# EAGLE design PlugRev1 (EAGLE 7.5.0)
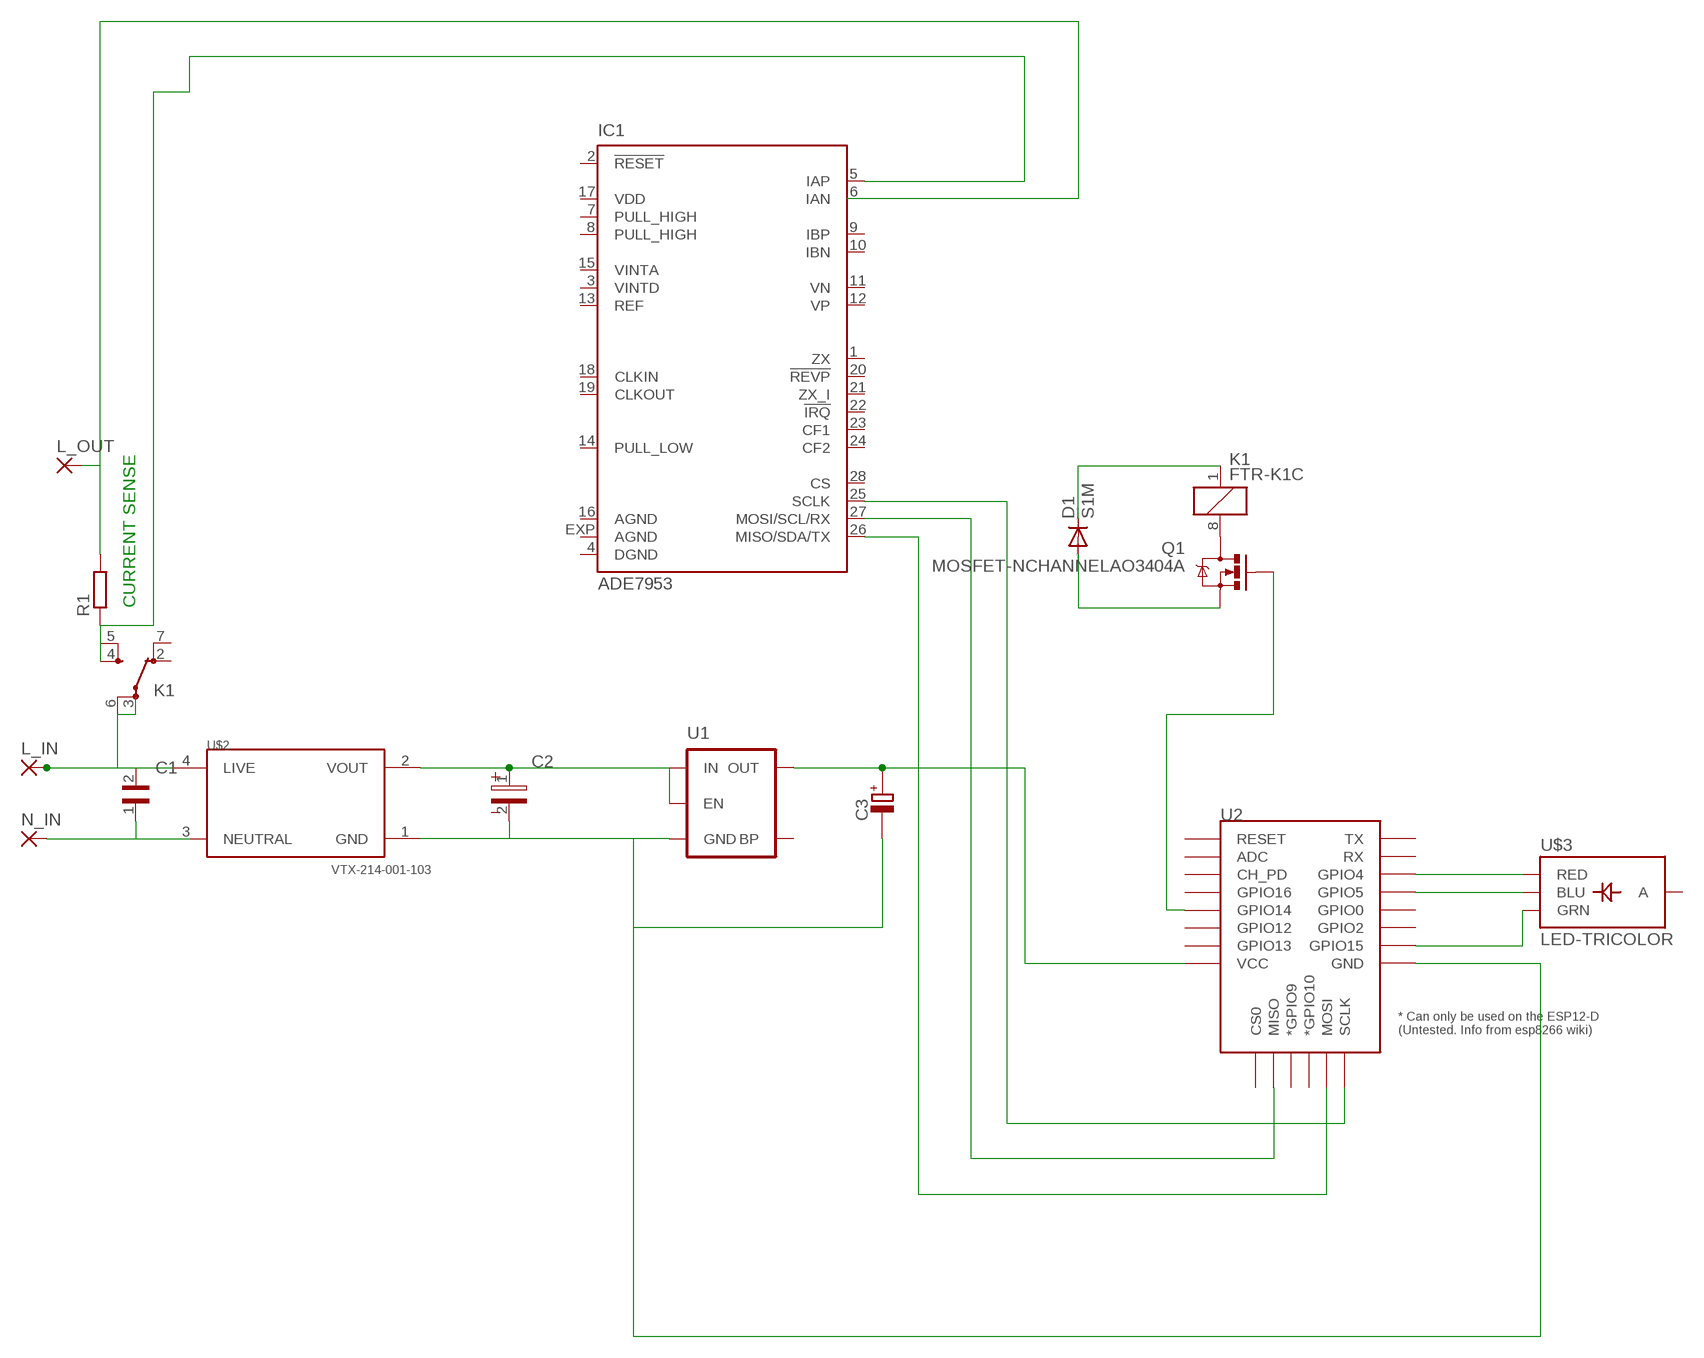
[diagram p0: schematic, sheet 1]

## Parts
C1  WCAP-FTX2_890324023024CS  [WCAP-FTX2_10X13X13X7]
C2  WCAP-ASLI_6.3X5.5(DXL)  [3.5X1.6X2.1(BXCXA)]
C3  POLARISED_CASE_A  [CAPAE330X540N]
D1  S1M  [SMA]
IC1  ADE7953  [QFN28-ML]
K1  FTR-K1C  [FTR-K1C]
L_IN  3,81/1,4  [3,81/1,4]
L_OUT  3,81/1,4  [3,81/1,4]
N_IN  3,81/1,4  [3,81/1,4]
Q1  MOSFET-NCHANNELAO3404A  [SOT23-3]
R1  R-EU_R3216  [R3216]
U1  MIC52053.3V  [SOT23-5]
U2  ESP12ESMD  [ESP12E-SMD]
U$2  VTX-214-001-103  [VTX214001103]
U$3  LED-TRICOLOR  [LED-TRICOLOR-SMD]

## Nets
GND: C2.2 C3.- U1.2(GND) U2.GND U$2.1(GND)
N$1: C3.+ U1.5(OUT) U2.VCC
N$2: IC1.5(IAP) K1.4(-1:SA) K1.5(-1:SB) R1.1
N$3: C1.1 N_IN.1(P)
N$4: C1.2 K1.6(-1:PB) L_IN.1(P) U$2.4(LIVE)
N$5: K1.8 Q1.3(D)
N$6: D1.C K1.1
N$7: D1.A Q1.2(S)
N$8: L_OUT.1(P) R1.2
N$9: IC1.26(MISO/SDA/TX) U2.MOSI
N$10: IC1.27(MOSI/SCL/RX) U2.MISO
N$11: IC1.25(SCLK) U2.SCLK
N$13: Q1.1(G) U2.GPIO14
N$14: U2.GPIO4 U$3.R(RED)
N$15: U2.GPIO5 U$3.B(BLU)
N$16: U2.GPIO15 U$3.G(GRN)
VOUT: C2.1 U1.1(IN) U1.3(EN) U$2.2(VOUT)
Unconnected: IC1.1(ZX) IC1.2(!RESET!) IC1.3(VINTD) IC1.6(IAN) IC1.7(PULL_HIGH) IC1.8(PULL_HIGH) IC1.9(IBP) IC1.10(IBN) IC1.11(VN) IC1.12(VP) IC1.13(REF) IC1.14(PULL_LOW) IC1.15(VINTA) IC1.18(CLKIN) IC1.19(CLKOUT) IC1.20(!REVP!) IC1.21(ZX_I) IC1.22(!IRQ!) IC1.23(CF1) IC1.24(CF2) IC1.28(CS) K1.2(-1:OA) K1.3(-1:PA) K1.7(-1:OB) U1.4(BP) U2.ADC U2.CH_PD U2.CS0 U2.GPIO0 U2.GPIO2 U2.GPIO9(*GPIO9) U2.GPIO10(*GPIO10) U2.GPIO12 U2.GPIO13 U2.GPIO16 U2.RESET U2.RXD0(RX) U2.TXD0(TX) U$2.3(NEUTRAL) U$3.A

## Notes on the sheet
- CURRENT SENSE

## Power pins joined to a net without a drawn wire
AGND: IC1.16(AGND) IC1.EXP(AGND)
DGND: IC1.4(DGND)
VDD: IC1.17(VDD)

## Library data of the parts
C1 = Wurth_Elektronik_Passive_Capacitors_rev15a:WCAP-FTX2: WCAP-FTX2 Film Capacitors Characteristics MKP,Metallized Polypropylene Film Recommended soldering :Wave Operating temperature:-40 °C to +105 °C Climate category:40/105/56/B Self-healing properties Certificates: cULus, CQC, VDE Applications Safety applications Filter Power supplies <http://katalog.we-online.de/media/images/eisos/WCAP-FTX2_pf2.jpg> Details see: http://katalog.we-online.de/en/pbs/WCAP-FTX2/890324022007CS?m Created: 2015-01-22 2015 (C) Wurth Elektronik
C2 = Wurth_Elektronik_Passive_Capacitors_rev15a:WCAP-ASLI: WCAP-ASLI Aluminum Electrolytic Capacitors Characteristics Aluminum Electrolytic Capacitor Recommended soldering: Reflow Operating temperature: -55 °C to +105 °C Low impedance product series Load life:2000 h @ +105 °C Package name and Variant abbreviation: Package: Package: B X C X A = length of the solder pad X width of the solder pad X pitch of the solder pad. Variant: D X L = Diameter of the body part X Height of the body part. <http://katalog.we-online.de/media/images/eisos/WCAP-ASLI_pf2.jpg> Details see: http://katalog.we-online.de/en/pbs/WCAP-ASLI?m Created: 2015-03-10 2015 (C) Wurth Elektronik
C3 = ipc-7351-capacitor:POLARISED_
D1 = diode:S1M
IC1 = analog-devices2:ADE7953: Single Phase, Multifunction Metering IC with Neutral Current Measurement Source: http://www.analog.com/static/imported-files/data_sheets/ADE7953.pdf http://www.analog.com/static/imported-files/jp/data_sheets/ADE7953_jp.pdf
K1 = relay:FTR-K1C: NETZRELAIS FTR-K1CK024W1XUM 16A/250VAC 1 Umschaltkontakt Distributor: Conrad Electronic Bestell Nr.: 504389-13 - 24V Source: http://www.produktinfo.conrad.com/datenblaetter/500000-524999/504384-da-01-de-NETZRELAIS_FTR_K1CK012W1XUM_16A_250VAC.pdf; OC_FARNELL: unknown; OC_NEWARK: unknown
L_IN L_OUT N_IN = wirepad:3,81/1,4: THROUGH-HOLE PAD
Q1 = SparkFun-DiscreteSemi:MOSFET-NCHANNEL: Common NMOSFET Parts MFG P/N Store ID Prod ID FDD8780 TRANS-09984 SI7820DN TRANS-11055 FDS6630A IC-08089 2N7002PW TRANS-11151 FQP30N06L COM-10213 TRANS-10060 BSS123LT1G TRANS-08345 BSS138 TRANS-00830 BS170 2N7000; PROD_ID: TRAN-12988
R1 = resistor:R-EU_: RESISTOR, European symbol
U1 = SparkFun-PowerIC:MIC5205: MIC5205 150mA vreg 3.3V - VREG-00822 5V - VREG-00823; PROD_ID: VREG-00822
U2 = esp8266modules:ESP12E: ESP12E Module
U$2 = VTX-214-001-103:VTX-214-001-103
U$3 = SparkFun-LED:LED-TRICOLOR: Tri-Color LED SMD Proven layout and schematic for triple color LED in SMD package - common anode. Spark Fun Electronics SKU : COM-07844

## Board
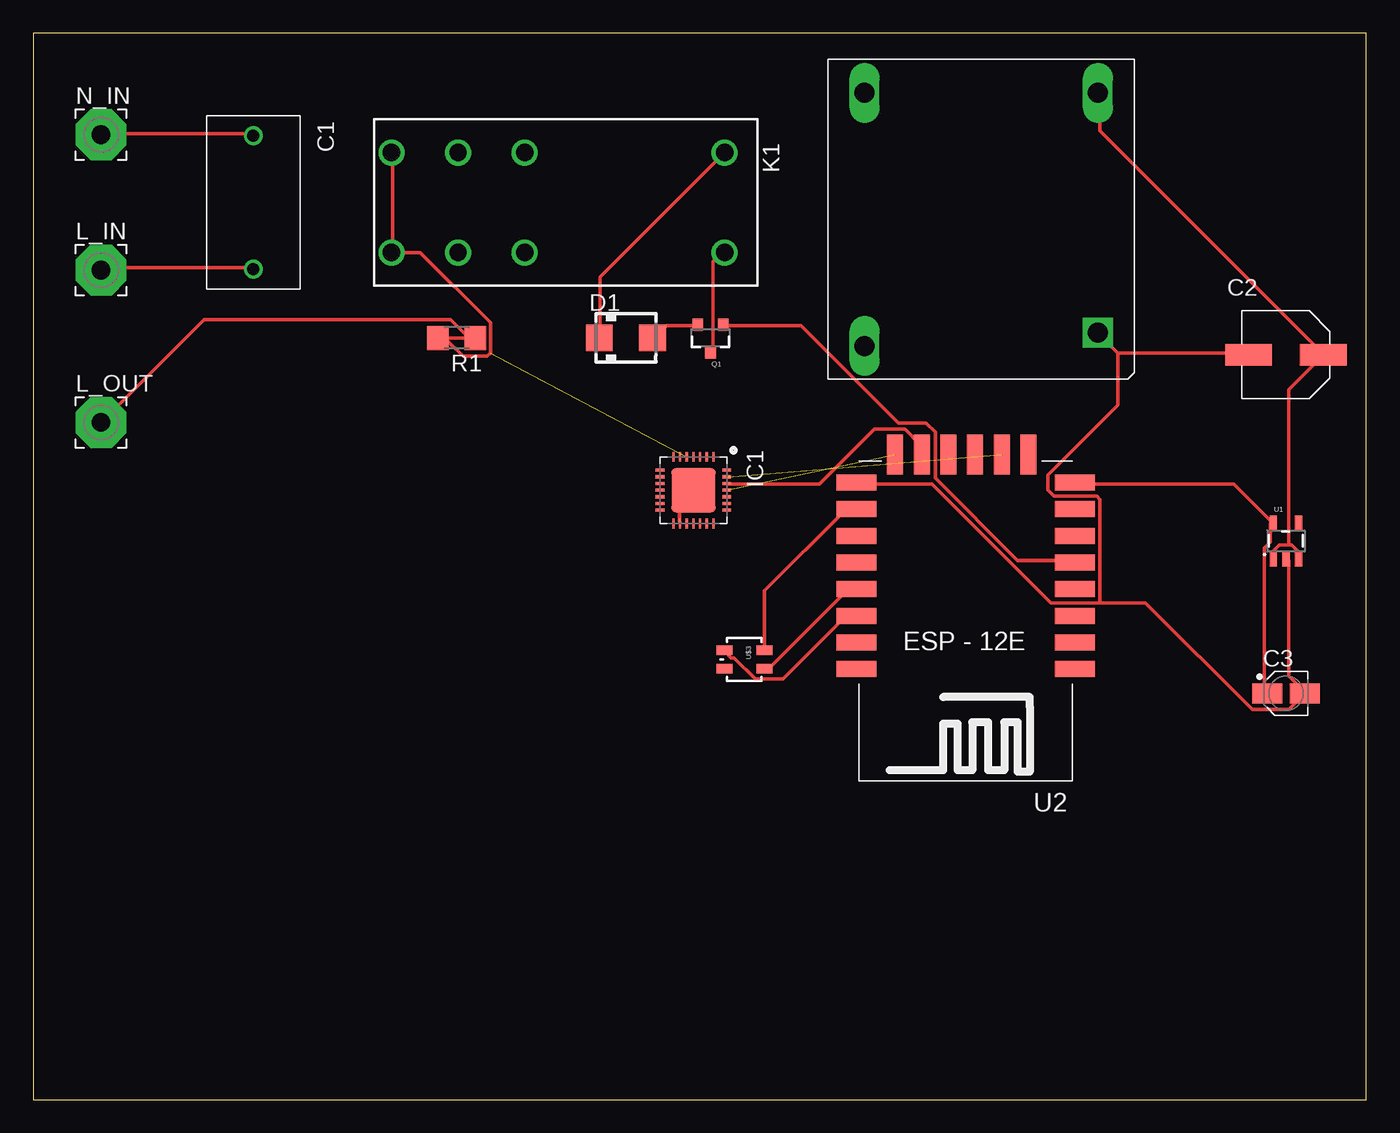
[diagram p1: board, top side]
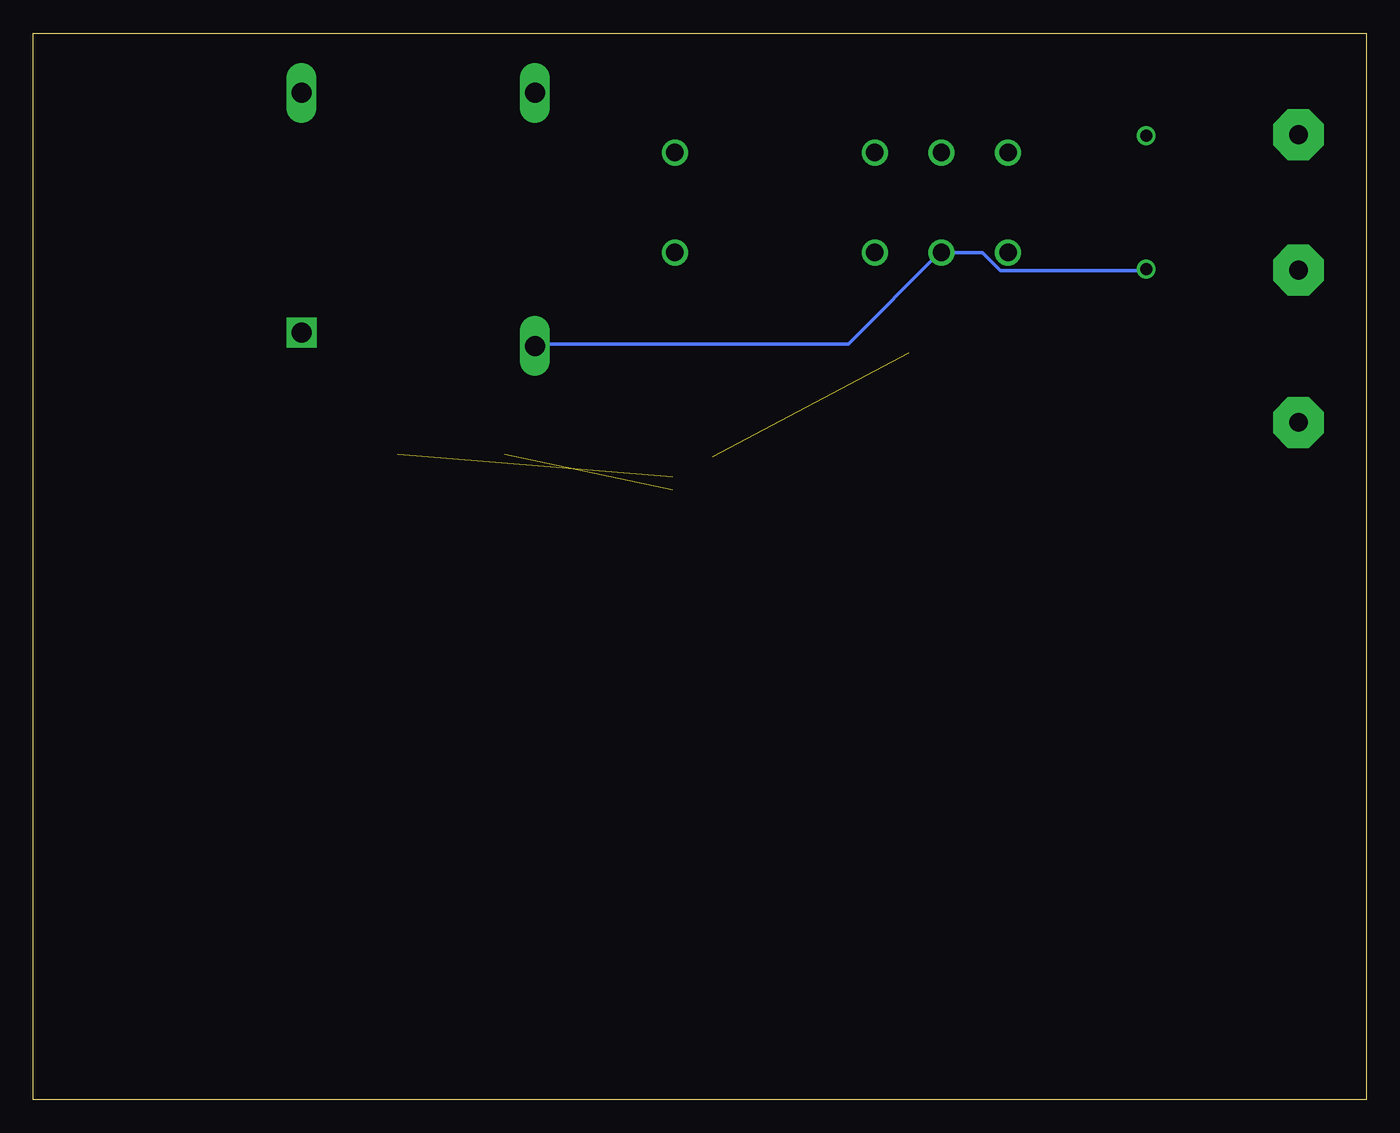
[diagram p2: board, bottom side, seen from below]

Size 100 x 80 mm. Coordinates in mm from the lower left corner, seen from the top.
Outline: 0,0 100,0 100,80 0,80 0,0
Copper layers (1*16): Top 0.035mm / dielectric 1.5mm / Bottom 0.035mm
Design rules "default": minimum track width 10mil, minimum drill 24mil, track to track 8mil, track to pad 8mil, pad to pad 8mil, via to via 8mil, smd to smd 8mil, copper to edge 40mil, drill to drill 8mil, minimum pad ring 10mil, minimum via ring 8mil, stop-mask expansion 4mil, vias tented up to drill 0mil, thermal gap 10mil

### Footprints (pad centres in the part's own frame; a part is rotated, then mirrored left to right if it is on the bottom)
WCAP-FTX2_10X13X13X7 = drill 0.9: 1 -5,0; 2 5,0
3.5X1.6X2.1(BXCXA) = smd 3.5 x 1.6: 1 2.8,0; 2 -2.8,0
CAPAE330X540N = smd 2.25 x 1.5: + -1.4,0; - 1.4,0
SMA = smd 2 x 2: A 2,0; C -2,0
QFN28-ML = smd 0.7 x 0.2: 1 -2.5,1.5; 2 -2.5,1; 3 -2.5,0.5; 4 -2.5,0; 5 -2.5,-0.5; 6 -2.5,-1; 7 -2.5,-1.5; 15 2.5,-1.5; 16 2.5,-1; 17 2.5,-0.5; 18 2.5,0; 19 2.5,0.5; 20 2.5,1; 21 2.5,1.5 | smd 0.2 x 0.7: 8 -1.5,-2.5; 9 -1,-2.5; 10 -0.5,-2.5; 11 0,-2.5; 12 0.5,-2.5; 13 1,-2.5; 14 1.5,-2.5; 22 1.5,2.5; 23 1,2.5; 24 0.5,2.5; 25 0,2.5; 26 -0.5,2.5; 27 -1,2.5; 28 -1.5,2.5 | smd 3.3 x 3.3: EXP 0,0
FTR-K1C = drill 1.3 pad 1.93: 1 -12.5,-3.75; 2 2.5,-3.75; 3 7.5,-3.75; 4 12.5,-3.75; 5 12.5,3.75; 6 7.5,3.75; 7 2.5,3.75; 8 -12.5,3.75
3,81/1,4 = drill 1.397 pad 3.81 octagon: 1 0,0
SOT23-3 = smd 0.8 x 0.9: 1 -0.95,-1; 2 0.95,-1; 3 0,1.1
R3216 = smd 1.6 x 1.8: 1 -1.4,0; 2 1.4,0
SOT23-5 = smd 0.55 x 1.2: 1 -0.95,-1.3; 2 0,-1.3; 3 0.95,-1.3; 4 0.95,1.3; 5 -0.95,1.3
ESP12E-SMD = smd 3 x 1.2: ADC -8.3,3.8; CH_PD -8.3,1.8; GND 8.1,-8.2; GPIO0 8.1,-2.2; GPIO2 8.1,-4.2; GPIO4 8.1,1.8; GPIO5 8.1,-0.2; GPIO12 -8.3,-4.2; GPIO13 -8.3,-6.2; GPIO14 -8.3,-2.2; GPIO15 8.1,-6.2; GPIO16 -8.3,-0.2; RESET -8.3,5.8; RXD0 8.1,3.8; TXD0 8.1,5.8; VCC -8.3,-8.2 | smd 1.2 x 3: CS0 -4.8,-10.3; GPIO9 -0.8,-10.3; GPIO10 1.2,-10.3; MISO -2.8,-10.3; MOSI 3.2,-10.3; SCLK 5.2,-10.3
VTX214001103 = drill 1.5 square: 1 8.75,-8.5 | drill 1.5 long: 2 8.75,9.5; 3 -8.75,9.5; 4 -8.75,-9.5
LED-TRICOLOR-SMD = smd 0.7 x 1.2: A 0.7,-1.5; B 0.7,1.5; G -0.7,1.5; R -0.7,-1.5

### Placement (x,y rotation side)
C1  16.51,67.31 270 top
C2  93.98,55.88 0 top
C3  93.98,30.48 0 top
D1  44.45,57.15 0 top
IC1  49.53,45.72 270 top
K1  39.37,67.31 180 top
L_IN  5.08,62.23 0 top
L_OUT  5.08,50.8 0 top
N_IN  5.08,72.39 0 top
Q1  50.8,57.15 180 top
R1  31.75,57.15 180 top
U1  93.98,41.91 0 top
U2  69.85,38.1 180 top
U$2  71.12,66.04 0 top
U$3  53.34,33.02 270 top

### Tracks (layer width: path | path; a pad name or v marks a point on that pad's centre or on a via)
AGND
  Top 0.254: IC1.16 48.46,43.43 48.46,44.81 49.38,45.72 IC1.EXP
GND
  Top 0.254: 81.38,56.01 90.98,56.01 C2.2 | 81.38,56.01 80.01,57.38 U$2.1 | U1.2 94.18,40.46 94.18,31.77 95.33,30.63 C3.- 95.33,30.4 94.18,29.26 91.44,29.26 83.44,37.26 80.01,37.26 | 80.01,37.26 76.35,37.26 67.44,46.18 61.95,46.18 U2.GND | 81.38,56.01 81.38,52.12 76.12,46.86 76.12,45.72 76.58,45.26 79.78,45.26 80.01,45.03 80.01,37.26
N$1
  Top 0.254: C3.+ 92.35,30.63 92.35,41.38 92.81,41.83 92.81,43.2 U1.5 92.81,43.43 90.07,46.18 78.18,46.18 U2.VCC
N$2  (1 unrouted)
  Top 0.254: R1.1 30.86,57.15 32.23,55.78 34.06,55.78 34.29,56.01 34.29,58.29 29.03,63.55 26.98,63.55 K1.5 26.98,63.78 26.98,70.87 K1.4
N$3
  Top 0.254: C1.1 16.46,72.47 5.26,72.47 N_IN.1
N$4
  Top 0.254: C1.2 16.46,62.41 5.26,62.41 L_IN.1
  Bottom 0.254: C1.2 16.69,62.18 27.43,62.18 28.8,63.55 31.77,63.55 K1.6 32,63.55 38.86,56.69 62.18,56.69 U$2.4
N$5
  Top 0.254: Q1.3 50.98,56.24 50.98,62.87 51.66,63.55 K1.8
N$6
  Top 0.254: D1.C 42.52,57.15 42.52,61.72 51.66,70.87 K1.1
N$7
  Top 0.254: Q1.2 49.84,58.06 47.55,58.06 46.63,57.15 D1.A
N$8
  Top 0.254: R1.2 32.69,57.15 31.32,58.52 12.8,58.52 L_OUT.1
N$9
  Top 0.254: IC1.26 52.12,46.18 58.98,46.18 63.09,50.29 65.38,50.29 66.52,49.15 66.52,48.46 U2.MOSI
N$10  (1 unrouted)
N$11  (1 unrouted)
N$13
  Top 0.254: Q1.1 51.89,58.06 57.61,58.06 64.92,50.75 66.98,50.75 67.67,50.06 67.67,46.63 73.84,40.46 77.95,40.46 U2.GPIO14
N$14
  Top 0.254: U$3.R 51.89,33.6 52.35,33.15 52.58,33.15 54.18,31.55 56.24,31.55 60.81,36.12 61.72,36.12 U2.GPIO4
N$15
  Top 0.254: U$3.B 54.86,32.46 55.32,32.46 61.04,38.18 61.72,38.18 U2.GPIO5
N$16
  Top 0.254: U$3.G 54.86,33.83 54.86,38.18 60.81,44.12 61.72,44.12 U2.GPIO15
VOUT
  Top 0.254: 94.18,41.6 94.41,41.6 94.87,41.15 94.87,40.69 U1.3 | 94.18,41.6 93.5,41.6 93.04,41.15 93.04,40.69 U1.1 | 94.18,41.6 94.18,53.26 96.7,55.78 C2.1 96.7,56.01 80.01,72.69 80.01,75.44 U$2.2